# Altium schematic sheet Microccontroller.SchDoc: STM32 Microcontroller
size A3; Organization: Reichle & De-Massari; Address1: Binzstrasse 32; Address2: 8620 Wetzikon; Address3: Switzerland; DocumentNumber: 5
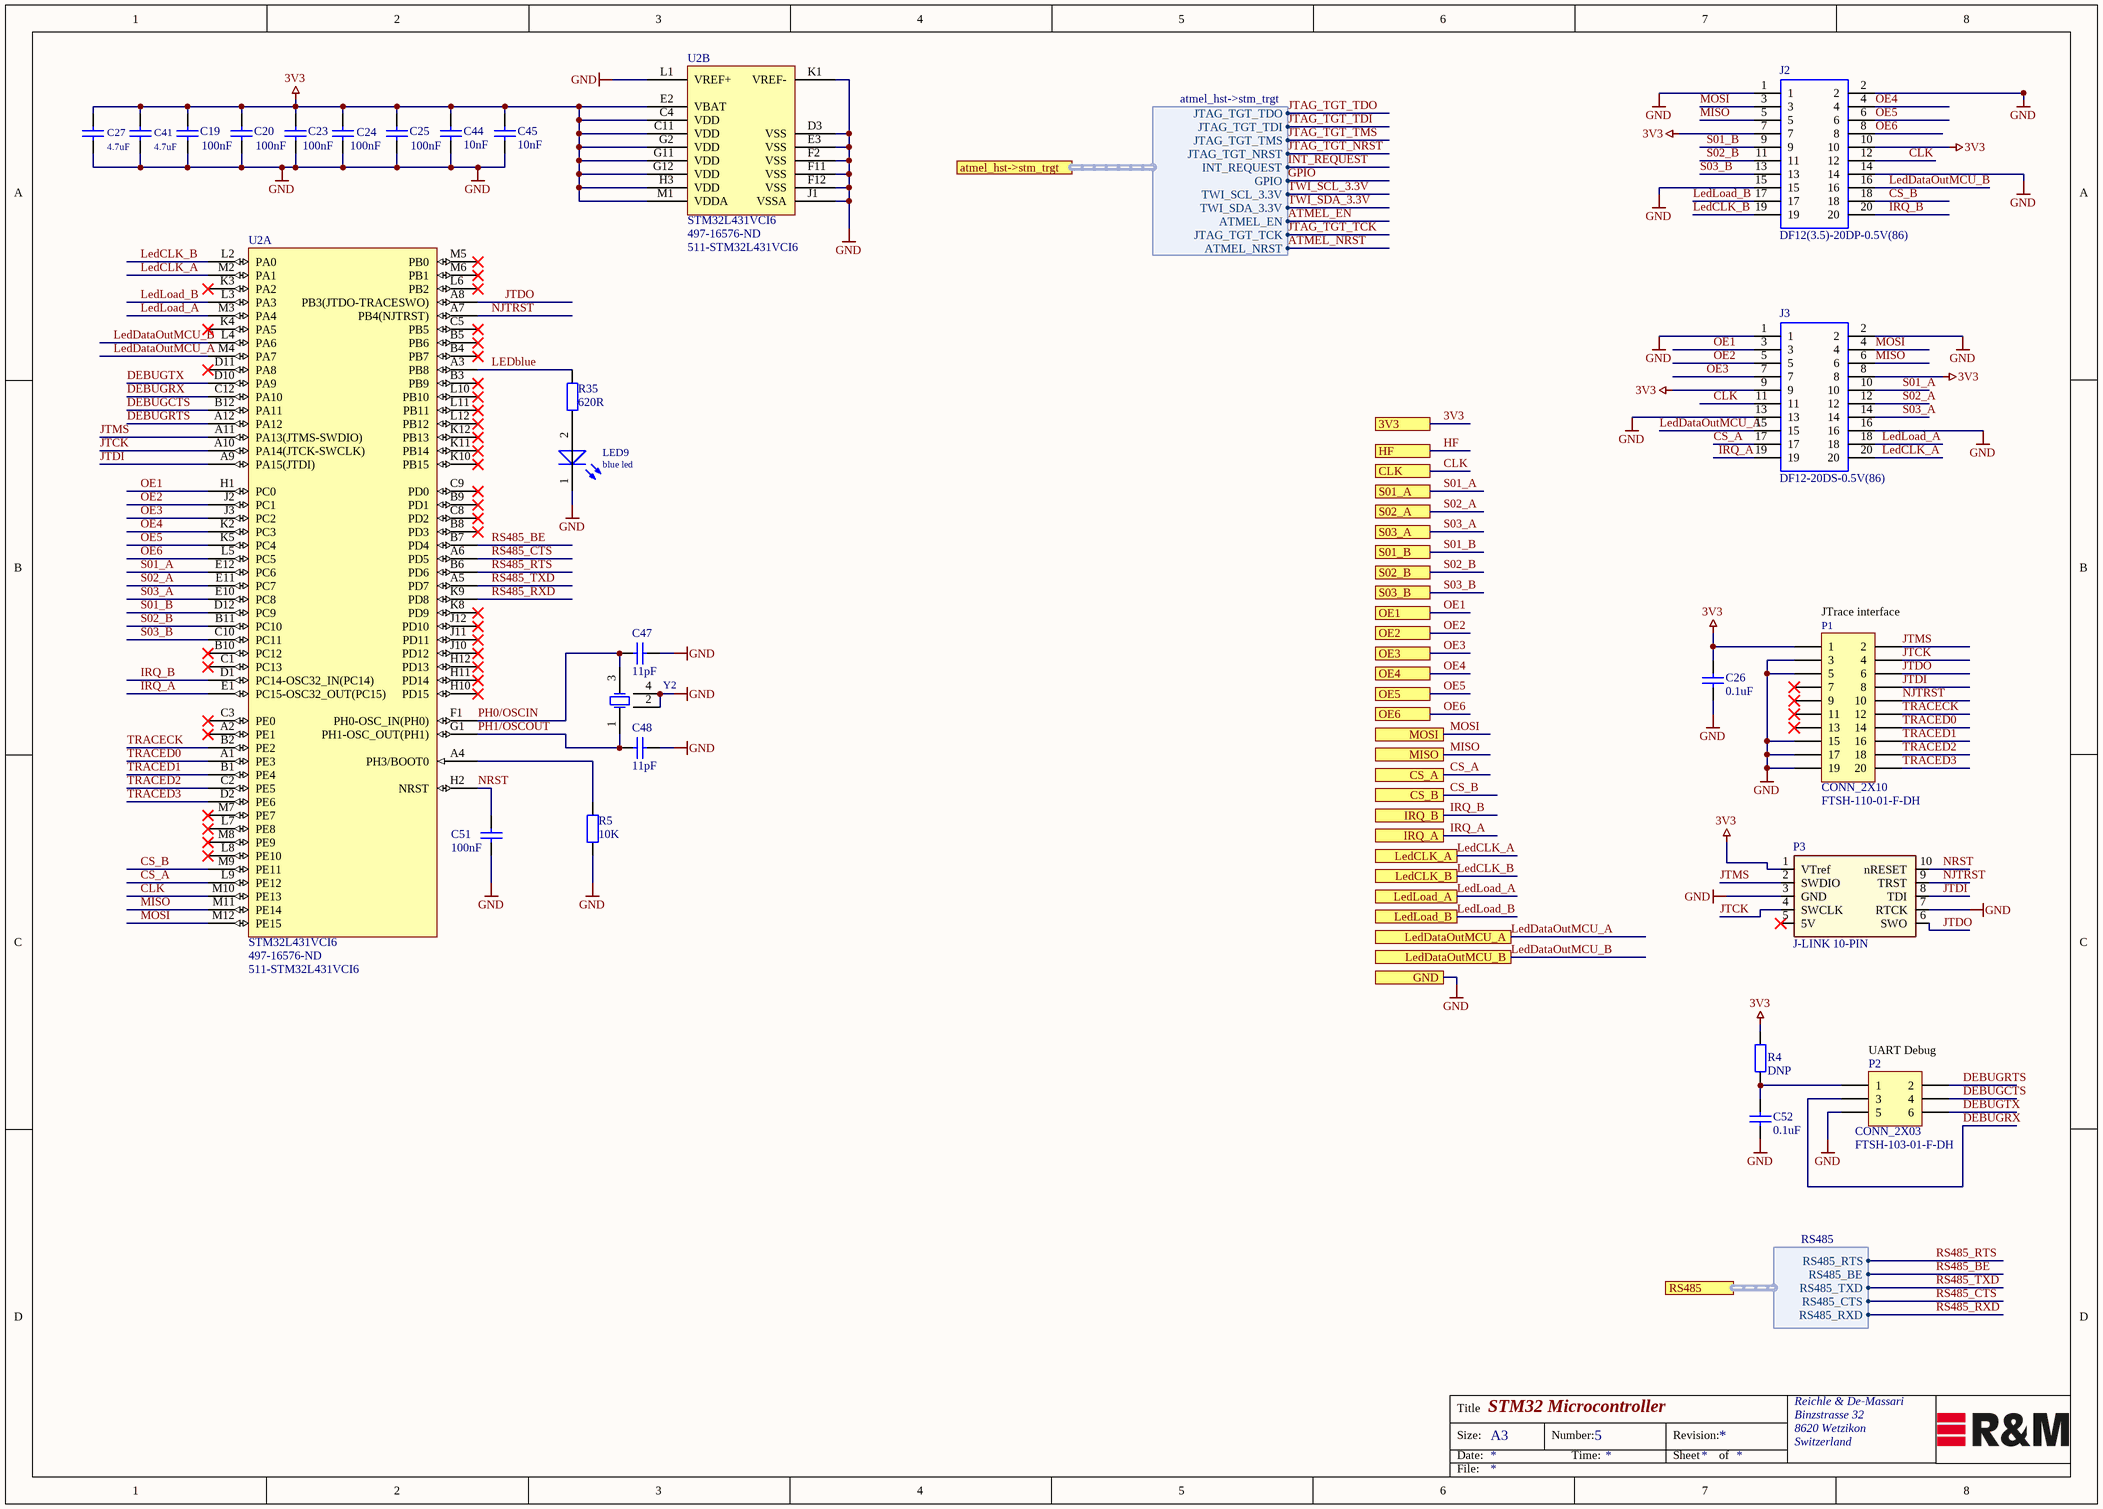
[diagram p0: Microccontroller.SchDoc]

## Parts
C19  100nF  [CAPC0402(1005)60_L]
C20  100nF  [CAPC0402(1005)60_L]
C23  100nF  [CAPC0402(1005)60_L]
C24  100nF  [CAPC0402(1005)60_L]
C25  100nF  [CAPC0402(1005)60_L]
C26  0.1uF  [CAPC1005X55N]
C27  value 4.7uF  [CAPC1005X55N]  (hidden comment: DNP)
C41  value 4.7uF  [CAP-0402[1005] - RFL]  (hidden comment: GRM155R60J475ME47D)
C44  10nF  [CAPC0402(1005)60_L]
C45  10nF  [CAPC0402(1005)60_L]
C47  11pF  [CAPC0402(1005)60_L]
C48  11pF  [CAPC0402(1005)60_L]
C51  100nF  [CAPC0402(1005)60_L]
C52  0.1uF  [Ceramic Capacitor 0402 EIA]
J2  DF12(3.5)-20DP-0.5V(86)  [DF12(4.0)-20DP]
J3  DF12-20DS-0.5V(86)  [DF12-20DS]
LED9  blue led  [Kingbright_SMD_2_RWH]
P1  CONN_2X10  [FTSH-110-01-F-DH]
P2  CONN_2X03  [FTSH-103-01-F-DH]
P3  J-LINK 10-PIN  [CONN-SEGGER-10-PIN]
R4  DNP  [RESC1005X40N]
R5  10K  [RESC1005X40N]
R35  620R  [Resistor 0402 EIA]
U2  STM32L431VCI6  Supplier Part Number 1: 497-16576-ND  Supplier Part Number 2: 511-STM32L431VCI6  [STM_UFBGA100 7x7x0.6_100_R]  (parts A,B of 2)
Y2  ECS-160-10-36Q-ES-TR  [ECS_ECX-2236_4_R]  (value not drawn)

## Ports
3V3, atmel_hst->stm_trgt (harness atmel_hst->stm_trgt), CLK, CS_A, CS_B, GND, HF, IRQ_A, IRQ_B, LedCLK_A, LedCLK_B, LedDataOutMCU_A, LedDataOutMCU_B, LedLoad_A, LedLoad_B, MISO, MOSI, OE1, OE2, OE3, OE4, OE5, OE6, RS485 (harness RS485), S01_A, S01_B, S02_A, S02_B, S03_A, S03_B

## Harnesses
RS485: RS485_RXD, RS485_CTS, RS485_TXD, RS485_BE, RS485_RTS
atmel_hst->stm_trgt: JTAG_TGT_TDO, JTAG_TGT_TDI, JTAG_TGT_TMS, JTAG_TGT_NRST, INT_REQUEST, GPIO, TWI_SCL_3.3V, TWI_SDA_3.3V, ATMEL_EN, JTAG_TGT_TCK, ATMEL_NRST

## Nets
3V3: C19.2 C20.2 C23.2 C24.2 C25.2 C26.2 C27.1(Pos) C41.1(Pos) C44.2 C45.2 J2.7 J2.10 J3.8 J3.9 P1.1 P3.1(VTref) R4.2 U2.C4(VDD) U2.C11(VDD) U2.E2(VBAT) U2.G2(VDD) U2.G11(VDD) U2.G12(VDD) U2.H3(VDD) U2.M1(VDDA) ; port 3V3
GND: C19.1 C20.1 C23.1 C24.1 C25.1 C26.1 C27.2(Neg) C41.2(Neg) C44.1 C45.1 C47.2 C48.2 C51.1 C52.1 J2.1 J2.2 J2.14 J2.15 J3.1 J3.2 J3.13 J3.16 LED9.1(K) P1.3 P1.5 P1.15 P1.17 P1.19 P2.5 P3.3(GND) P3.7(RTCK) R5.2 U2.D3(VSS) U2.E3(VSS) U2.F2(VSS) U2.F11(VSS) U2.F12(VSS) U2.J1(VSSA) U2.K1(VREF-) U2.L1(VREF+) Y2.2(OSC2) Y2.4(OSC3) ; port GND
ATMEL_EN: port atmel_hst->stm_trgt.ATMEL_EN
ATMEL_NRST: port atmel_hst->stm_trgt.ATMEL_NRST
CLK: J2.12 J3.11 U2.M10(PE13) ; port CLK
CS_A: J3.17 U2.L9(PE12) ; port CS_A
CS_B: J2.18 U2.M9(PE11) ; port CS_B
DEBUGCTS: P2.4 U2.B12(PA11)
DEBUGRTS: P2.2 U2.A12(PA12)
DEBUGRX: P2.3 U2.C12(PA10)
DEBUGTX: P2.6 U2.D10(PA9)
GPIO: port atmel_hst->stm_trgt.GPIO
HF: port HF
INT_REQUEST: port atmel_hst->stm_trgt.INT_REQUEST
IRQ_A: J3.19 U2.E1(PC15-OSC32_OUT(PC15)) ; port IRQ_A
IRQ_B: J2.20 U2.D1(PC14-OSC32_IN(PC14)) ; port IRQ_B
JTAG_TGT_NRST: port atmel_hst->stm_trgt.JTAG_TGT_NRST
JTAG_TGT_TCK: port atmel_hst->stm_trgt.JTAG_TGT_TCK
JTAG_TGT_TDI: port atmel_hst->stm_trgt.JTAG_TGT_TDI
JTAG_TGT_TDO: port atmel_hst->stm_trgt.JTAG_TGT_TDO
JTAG_TGT_TMS: port atmel_hst->stm_trgt.JTAG_TGT_TMS
JTCK: P1.4 P3.4(SWCLK) U2.A10(PA14(JTCK-SWCLK))
JTDI: P1.8 P3.8(TDI) U2.A9(PA15(JTDI))
JTDO: P1.6 P3.6(SWO) U2.A8(PB3(JTDO-TRACESWO))
JTMS: P1.2 P3.2(SWDIO) U2.A11(PA13(JTMS-SWDIO))
LEDblue: R35.2 U2.A3(PB8)
LedCLK_A: J3.20 U2.M2(PA1) ; port LedCLK_A
LedCLK_B: J2.19 U2.L2(PA0) ; port LedCLK_B
LedDataOutMCU_A: J3.15 U2.M4(PA7) ; port LedDataOutMCU_A
LedDataOutMCU_B: J2.16 U2.L4(PA6) ; port LedDataOutMCU_B
LedLoad_A: J3.18 U2.M3(PA4) ; port LedLoad_A
LedLoad_B: J2.17 U2.L3(PA3) ; port LedLoad_B
MISO: J2.5 J3.6 U2.M11(PE14) ; port MISO
MOSI: J2.3 J3.4 U2.M12(PE15) ; port MOSI
NJTRST: P1.10 P3.9(TRST) U2.A7(PB4(NJTRST))
NRST: C51.2 P3.10(nRESET) U2.H2(NRST)
OE1: J3.3 U2.H1(PC0) ; port OE1
OE2: J3.5 U2.J2(PC1) ; port OE2
OE3: J3.7 U2.J3(PC2) ; port OE3
OE4: J2.4 U2.K2(PC3) ; port OE4
OE5: J2.6 U2.K5(PC4) ; port OE5
OE6: J2.8 U2.L5(PC5) ; port OE6
PH0/OSCIN: C47.1 U2.F1(PH0-OSC_IN(PH0)) Y2.3(OSC2)
PH1/OSCOUT: C48.1 U2.G1(PH1-OSC_OUT(PH1)) Y2.1(OSC1)
RS485_BE: U2.B7(PD4) ; port RS485.RS485_BE
RS485_CTS: U2.A6(PD5) ; port RS485.RS485_CTS
RS485_RTS: U2.B6(PD6) ; port RS485.RS485_RTS
RS485_RXD: U2.K9(PD8) ; port RS485.RS485_RXD
RS485_TXD: U2.A5(PD7) ; port RS485.RS485_TXD
S01_A: J3.10 U2.E12(PC6) ; port S01_A
S01_B: J2.9 U2.D12(PC9) ; port S01_B
S02_A: J3.12 U2.E11(PC7) ; port S02_A
S02_B: J2.11 U2.B11(PC10) ; port S02_B
S03_A: J3.14 U2.E10(PC8) ; port S03_A
S03_B: J2.13 U2.C10(PC11) ; port S03_B
TRACECK: P1.12 U2.B2(PE2)
TRACED0: P1.14 U2.A1(PE3)
TRACED1: P1.16 U2.B1(PE4)
TRACED2: P1.18 U2.C2(PE5)
TRACED3: P1.20 U2.D2(PE6)
TWI_SCL_3.3V: port atmel_hst->stm_trgt.TWI_SCL_3.3V
TWI_SDA_3.3V: port atmel_hst->stm_trgt.TWI_SDA_3.3V
NetC52_2: C52.2 P2.1 R4.1
NetLED9_2: LED9.2(A) R35.1
NetR5_1: R5.1 U2.A4(PH3/BOOT0)

Not connected (* = marked no-connect by the designer): P1 7* 9* 11* 13*; P3 5(5V)*; U2 A2(PE1)* B3(PB9)* B4(PB7)* B5(PB6)* B8(PD3)* B9(PD1)* B10(PC12)* C1(PC13)* C3(PE0)* C5(PB5)* C8(PD2)* C9(PD0)* D11(PA8)* H10(PD15)* H11(PD14)* H12(PD13)* J10(PD12)* J11(PD11)* J12(PD10)* K3(PA2)* K4(PA5)* K8(PD9)* K10(PB15)* K11(PB14)* K12(PB13)* L6(PB2)* L7(PE8)* L8(PE10)* L10(PB10)* L11(PB11)* L12(PB12)* M5(PB0)* M6(PB1)* M7(PE7)* M8(PE9)*

## Notes on the sheet
- (near P1) JTrace interface
- (near P2) UART Debug
- Title
- Size:
- Date:
- A3
- Number:
- Time:
- Revision:
- Sheet
- of
- File:

## Library data of the parts
C19 C20 C23-C25 C51 = CAP 100nF 10V 0402(1005): CAP 100nF 10V ±10% 0402 (1005 Metric) Thickness 0.6mm SMD; Case-EIA: 0402; Case-Metric: 1005; Tolerance: Â±10%; Max Thickness: 0.6 mm; Value: 100nF; Rated Voltage: 10 V; Technology: SMT
C26 C52 = Cap_0.1uF_0402: SMD/SMT WCAP-CSGP 0.1uF 0402 20% 10V MLCC; Manufacturer: Wurth Electronics; Manufacturer PartNr: 885012105010; voltage: 10VDC; Dielectric Grade: X5R; Replaceable: yes; value: 0.1uF; tolerance: 20%; ComponentLink1Description: mouser; ComponentLink1URL: https://www.mouser.ch/ProductDetail/Wurth-Electronics/885012105010?qs=sGAEpiMZZMs0AnBnWHyRQEGbLOF2VP1ihL84oCjXnlO407YOHi%2fQbw%3d%3d; Footprint/Package: 0402; Supplier 1: Mouser; Supplier 2: Farnell; Supplier Part Number 1: 710-885012105010; Supplier Part Number 2: 2533928; Supplier 3: Digi-Key; Supplier Part Number 3: 732-7487-1-ND
C27 = Cap_4.7uF_0402(1005): 4.7uF, Chip Monolithic Ceramic Condensators; Manufacturer: Murata; Manufacturer PartNr: GRM155R60J475ME47D
C41 = Cap_4.7uF_0402(1005): 4.7uF, Chip Monolithic Ceramic Condensators; Manufacturer: Murata; Manufacturer PartNr: GRM155R60J475ME47D
C44 C45 = CAP_10nf_10V_0402(1005): CAP 10nF 10V ±10% 0402 (1005 Metric) Thickness 0.6mm SMD; Case-Metric: 1005; Case-EIA: 0402; Tolerance: Â±10%; Rated Voltage: 10 V; Technology: SMT; Max Thickness: 0.6 mm; Value: 10nF
C47 C48 = CAP 11pF 10V 0402(1005): CAP 11pF 10V ±0.25pF 0402 (1005 Metric) Thickness 0.6mm SMD; Case-EIA: 0402; Case-Metric: 1005; Tolerance: Â±0.25pF; Value: 11pF; Max Thickness: 0.6 mm; Rated Voltage: 10 V; Technology: SMT
J2 = DF12(3.5)-20DP-0.5V(86): Connector,Board to Board,DF12 Hirose DF12 Series, 0.5mm Pitch 20 Way 2 Row Straight PCB Header, Solder Termination, 0.3A; Allied_Number: R1051072; Manufacturer: Hirose; Manufacturer PartNr: DF12(3.5)-20DP-0.5V(86); RS Part Number: 6082064P; RS Price/Stock: http://uk.rs-online.com/web/p/products/6082064P; Allied Price/Stock: http://www.alliedelec.com/hirose-electric-df12-3-5-20dp-0-5v-86-/R1051072/; Mouser Part Number: 798-DF123520DP0.5V86; Mouser Price/Stock: https://www.mouser.com/Search/Refine.aspx?Keyword=798-DF123520DP0.5V86; Datasheet Link: https://www.hirose.com/product/en/download_file/key_name/DF12/category/Catalog/doc_file_id/31693/?file_category_id=4&item_id=23&is_series=1.pdf
J3 = DF12-20DS-0.5V(86): Connector,Board to Board,DF12 Hirose DF12 Series 0.5mm 20 Way 2 Row Straight PCB Socket Surface Mount Board to Board; Allied_Number: R1051087; Manufacturer: Hirose; Manufacturer PartNr: DF12-20DS-0.5V(86); RS Part Number: 1722478; RS Price/Stock: http://uk.rs-online.com/web/p/products/1722478; Allied Price/Stock: http://www.alliedelec.com/hirose-electric-df12-20ds-0-5v-86-/R1051087/; Mouser Part Number: 798-DF12-20DS-0.5V86; Mouser Price/Stock: https://www.mouser.com/Search/Refine.aspx?Keyword=798-DF12-20DS-0.5V86; Datasheet Link: https://www.hirose.com/product/en/products/DF12
LED9 = APA1606VBC/D: blue, 1.6 x 0.6 mm Right Angle SMD Chip LED Lamp; Manufacturer: Kingbright; Replaceable: yes; Manufacturer PartNr: APA1606VBC/D; ComponentLink1Description: mouser; ComponentLink1URL: https://www.mouser.ch/ProductDetail/Kingbright/APA1606VBC-D?qs=%2fha2pyFaduhFkLoQLKawdk3E%252bl3FgSOr3Fif4NOc1lJmKkWDM5WlaQ%3d%3d; Footprint/Package: specific, see datasheet; Supplier 1: Digi-Key; Supplier Part Number 1: 754-2090-6-ND
P1 = CONN_2X10_FTSH-110-01-F-DH: 20Pin, 2Rows, side/horizontally, MICRO LOW-PROFILE TERMINAL STRIPS; Manufacturer: Samtec; Replaceable: no; Manufacturer PartNr: FTSH-110-01-F-DH; ComponentLink1Description: mouser; ComponentLink1URL: https://www.mouser.ch/ProductDetail/Samtec/FTSH-110-02-F-DH?qs=sGAEpiMZZMs%252bGHln7q6pm8Vn94ktop%2fJX5D4YaS%252bHqWex9Ov5NBeXw%3d%3d; Footprint/Package: 1.27 mm; Supplier 1: Digi-Key; Supplier 2: Farnell; Supplier 3: Mouser; Supplier Part Number 1: SAM11236-ND; Supplier Part Number 2: 2856415; Supplier Part Number 3: 200-FTS11002FDV
P2 = CONN_2X03_FTSH-103-01-F-DH: 6Pin, 2Rows, MICRO LOW-PROFILE TERMINAL STRIPS; Manufacturer: Samtec; Replaceable: no; Manufacturer PartNr: FTSH-103-01-F-DH; Footprint/Package: 1.27 mm
P3 = CONN_Segger_10_PIN: Segger, J-Link 10-pin Needle Adapter
R4 = Res_DNP_0402: Resistor: do not populate; Replaceable: no; value: DNP; tolerance: *; power: *; Manufacturer: do not populate; Manufacturer PartNr: do not populate; Footprint/Package: 0402
R5 = PassResBas0402-00623-A.3: 10K 0.063W 1% 0402 (1005 Metric)  SMD; ValueAddON: 1% 0.063W; #ClassSub: Resistor SMD; #Class: Passiv-Components; Value: 10K; Status: nLager
R35 = Res_620R_0402: SMD 1/16W 620ohm 0.5% 25ppm; Manufacturer: Susumu; Manufacturer PartNr: RR0510P-621-D; power: 62.5mW; Replaceable: yes; value: 620R; tolerance: 0.5%; ComponentLink1Description: mouser; ComponentLink1URL: https://www.mouser.ch/ProductDetail/Susumu/RR0510P-621-D?qs=sGAEpiMZZMu61qfTUdNhG%2fDhcyQpRg8MIBVoO7KVzPo%3d; Footprint/Package: 0402; Supplier 1: Mouser; Supplier 2: Digi-Key; Supplier Part Number 1: 754-RR0510P-621D; Supplier Part Number 2: RR05P620DDKR-ND
U2 = STM32L431VCI6: Ultra-low-power Arm® Cortex®-M4 32-bit MCU+FPU, 100DMIPS, up to 256KB Flash, 64KB SRAM, analog, audio, UFBGA100 7x7x0.6_100; Manufacturer: STMicroelectronics; Replaceable: no; ComponentLink1Description: mouser; ComponentLink1URL: https://www.mouser.ch/ProductDetail/STMicroelectronics/STM32L431VCI6?qs=%2fha2pyFadugH5aS8CDb9Mm3u%252bAbg7zIVJiWcYxu1pWKDX51qWwrkAQ%3d%3d; Manufacturer PartNr: STM32L431VCI6; Footprint/Package: UFBGA-100; Supplier 1: Digi-Key; Supplier 2: Mouser
Y2 = CRYSTAL_4Pin_1_3: 48MHz, SMD CRYSTAL; Manufacturer: ECS; Manufacturer PartNr: ECS-480-10-36-CKL-TR; Replaceable: no; ShortDescription: 48MHz; Footprint/Package: 2.5 x 2.0 mm; ComponentLink1Description: mouser; ComponentLink1URL: https://www.mouser.ch/ProductDetail/ECS/ECS-480-10-36-CKL-TR?qs=%2fha2pyFaduiJDDUMn7kLm%2fCYfOvqPL5iL4hK6g%252bPFacvo4wWhO4d4UMTkDEH%252bJpH; Supplier 1: Mouser; Supplier Part Number 1: 520-480-10-36-CKLT